# Altium project Prj_ROBOT_HUT_BUI.PrjPcb
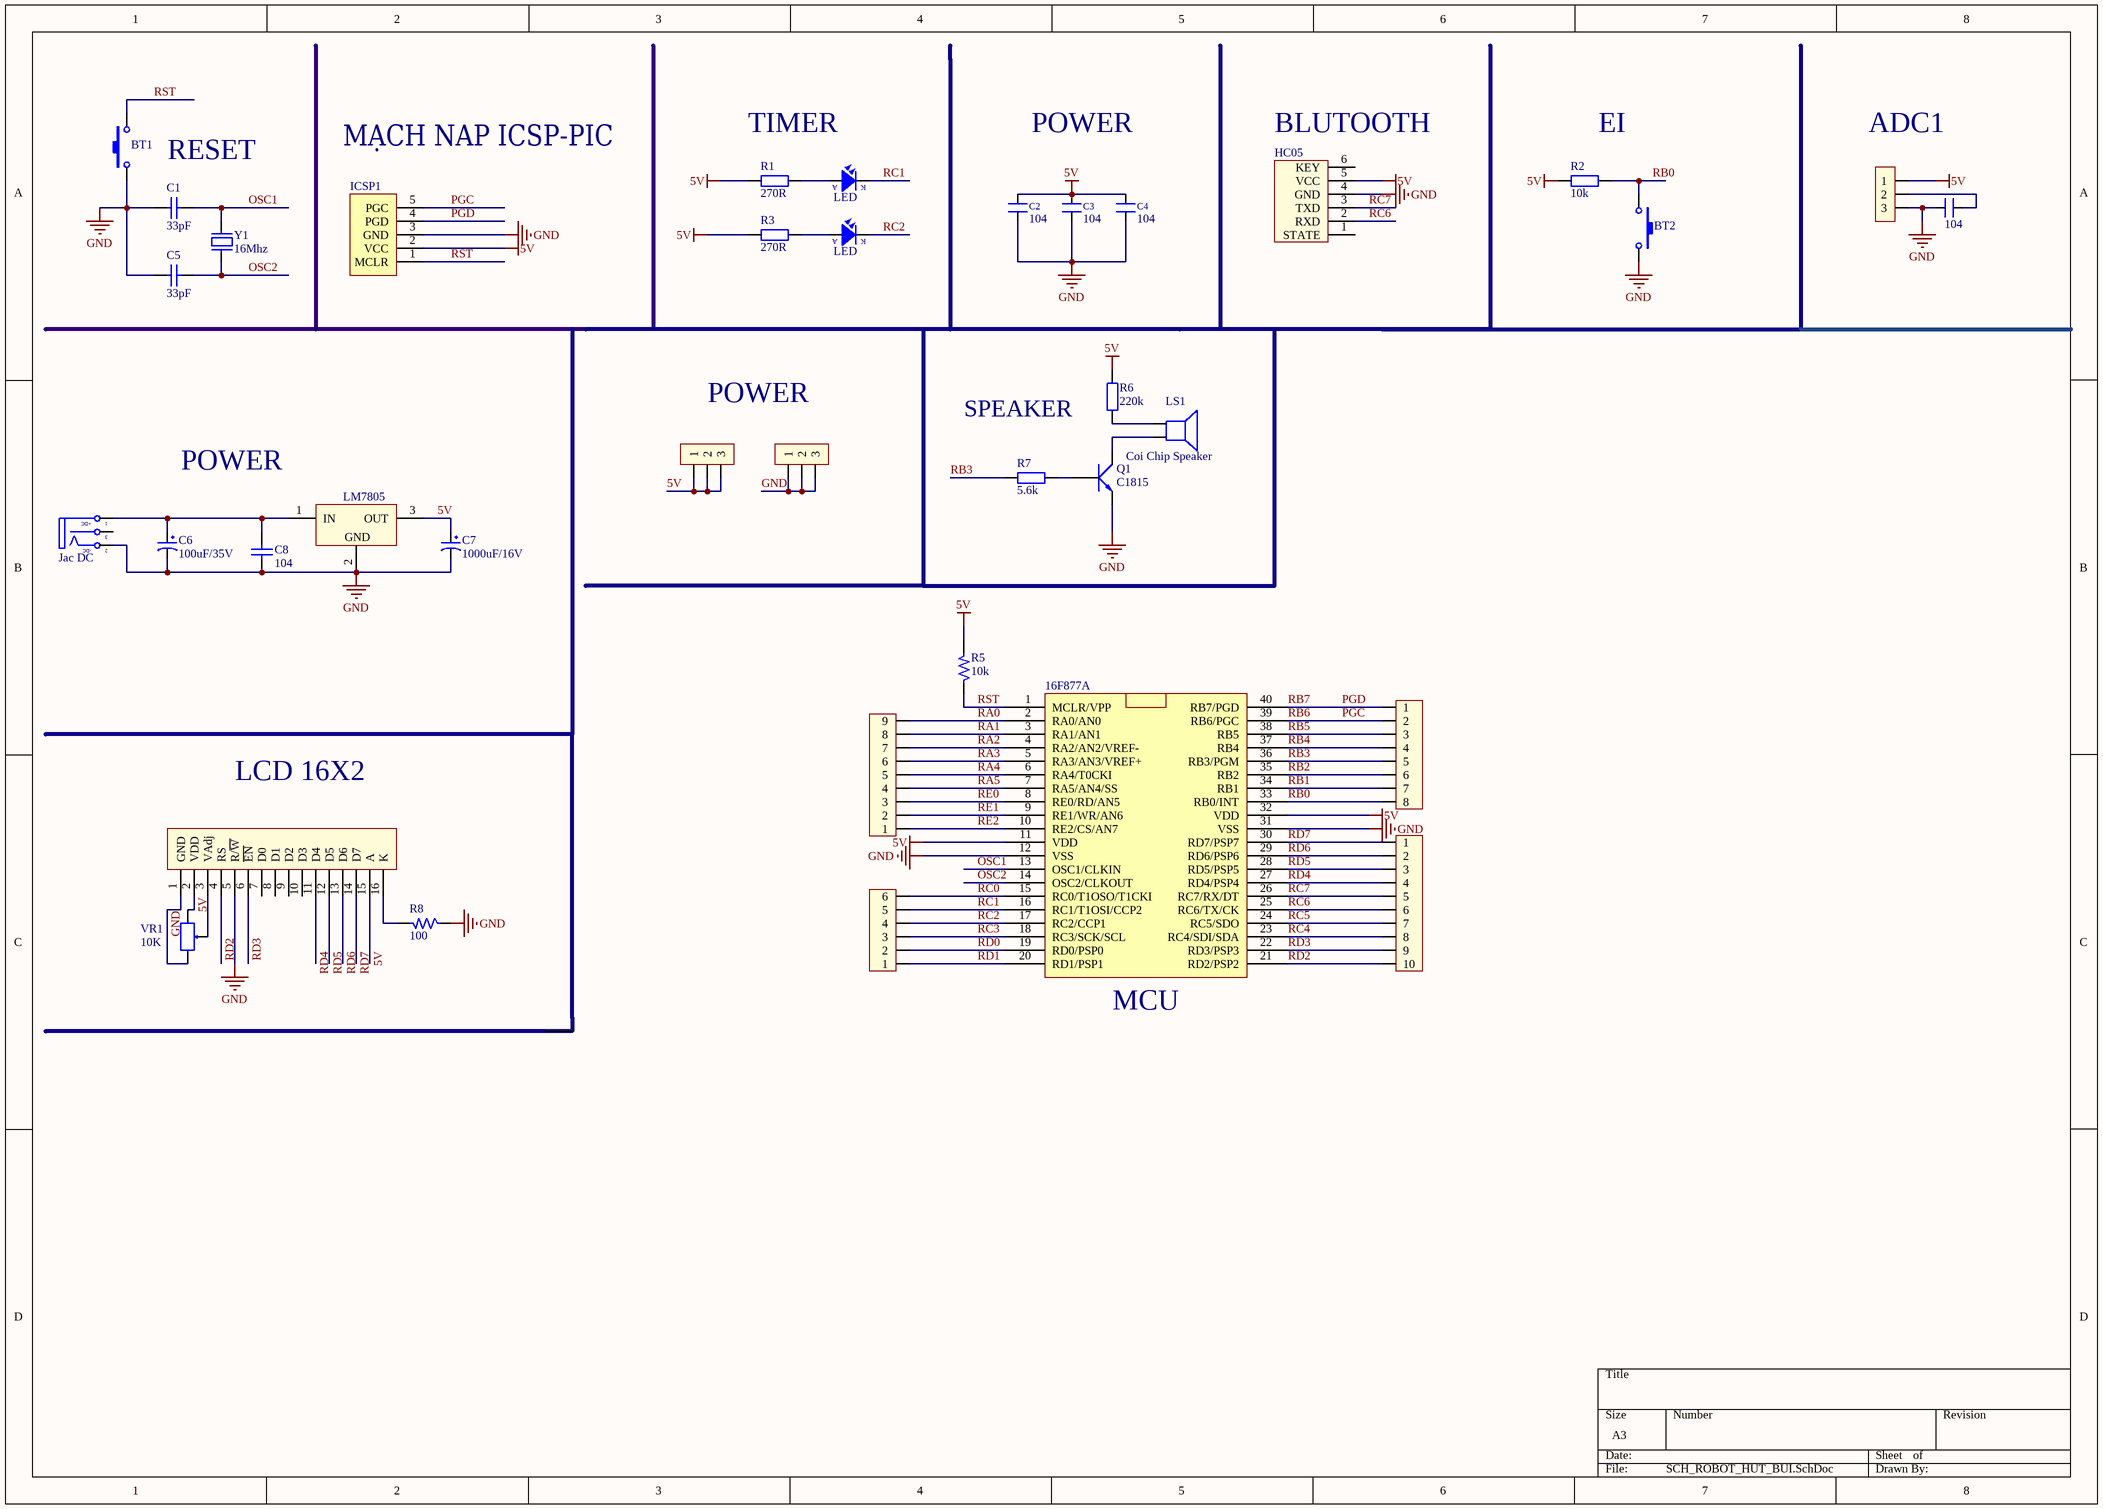
[diagram p0: SCH_ROBOT_HUT_BUI.SchDoc]
1 sheet, 37 parts. Net scope: global (net labels, ports and power ports of the same name join across sheets).
Board file: PCB_ROBOT_HUT_BUI.PcbDoc

## Sheet SCH_ROBOT_HUT_BUI.SchDoc
size A3

### Parts
ADC1  Jumper 3  [JP3]  (value not drawn)
BT1  Nut Nhan 2 Chan SMD 3x6x2.5  [Nut Nhan 2 Chan SMD 3x6x2.5]  (value not drawn)
BT2  Nut Nhan 2 Chan SMD 3x6x2.5  [Nut Nhan 2 Chan SMD 3x6x2.5]  (value not drawn)
C1  33pF  [tu 0805]
C2  104  [SM-CAP-0805]
C3  104  [SM-CAP-0805]
C4  104  [SM-CAP-0805]
C5  33pF  [tu 0805]
C6  100uF/35V  [CP1.5/3.4]
C7  1000uF/16V  [CP1.5/3.4]
C8  104  [tu 0805]
C9  104  [SM-CAP-0805]
HC05  HC05 Bluetooth  [HC05 Bluethooth Nam]  (value not drawn)
IC1  LM7805  [QTO-220]
IC2  16F877A  [DIP40/W0.6]
ICSP1  ICSP-PIC  [HDR1X5]  (value not drawn)
J1  Jumper 3  [JP3]  (value not drawn)
J3  Jumper 3  [JP3]  (value not drawn)
JDC1  Jac DC  [DC-IN]
JP1  JP8  [CON8]  (value not drawn)
JP2  connector  [con9]  (value not drawn)
JP3  JP10  [CON10]  (value not drawn)
JP4  JP6  [CON6]  (value not drawn)
LCD1  LCD1602 XL  [LCD1602 with Jump]  (value not drawn)
LED1  LED  [LED-3]
LED2  LED  [LED-3]
LS1  Coi Chip Speaker  [Coi Chip Speacker]
Q1  C1815  [TO92]
R1  270R  [tro vach 1/4w]
R2  10k  [tro vach 1/4w]
R3  270R  [tro vach 1/4w]
R5  10k  [R1/4W]
R6  220k  [tro vach 1/2w]
R7  5.6k  [tro vach 1/4w]
R8  100  [SM-RES-1206]
VR1  10K  [VR]
Y1  16Mhz  [Thach Anh 2 chan SMD]

### Nets
5V: ADC1.1 C2.2 C3.2 C4.2 C7.1 HC05.5(VCC) IC1.3(OUT) IC2.11(VDD) IC2.32(VDD) ICSP1.2(VCC) J1.1 J1.2 J1.3 LCD1.2(VDD) LCD1.15(A) R1.1 R2.1 R3.1 R5.2 R6.2 VR1.1
GND: ADC1.3 BT1.1 BT2.2 C1.2 C2.1 C3.1 C4.1 C5.2 C6.2 C7.2 C8.2 C9.1 HC05.4(GND) IC1.2(GND) IC2.12(VSS) IC2.31(VSS) ICSP1.3(GND) J3.1 J3.2 J3.3 JDC1.2(TN) LCD1.1(GND) LCD1.5(R/~{W}) Q1.1(E) R8.1 VR1.3
OSC1: C1.1 IC2.13(OSC1/CLKIN) Y1.2
OSC2: C5.1 IC2.14(OSC2/CLKOUT) Y1.1
PGC: IC2.39(RB6/PGC) ICSP1.5(PGC) JP1.2  [also labelled RB6]
PGD: IC2.40(RB7/PGD) ICSP1.4(PGD) JP1.1  [also labelled RB7]
RA0: IC2.2(RA0/AN0) JP2.9
RA1: IC2.3(RA1/AN1) JP2.8
RA2: IC2.4(RA2/AN2/VREF-) JP2.7
RA3: IC2.5(RA3/AN3/VREF+) JP2.6
RA4: IC2.6(RA4/T0CKI) JP2.5
RA5: IC2.7(RA5/AN4/SS) JP2.4
RB0: BT2.1 IC2.33(RB0/INT) JP1.8 R2.2
RB1: IC2.34(RB1) JP1.7
RB2: IC2.35(RB2) JP1.6
RB3: IC2.36(RB3/PGM) JP1.5 R7.1
RB4: IC2.37(RB4) JP1.4
RB5: IC2.38(RB5) JP1.3
RC0: IC2.15(RC0/T1OSO/T1CKI) JP4.6
RC1: IC2.16(RC1/T1OSI/CCP2) JP4.5 LED1.2(K)
RC2: IC2.17(RC2/CCP1) JP4.4 LED2.2(K)
RC3: IC2.18(RC3/SCK/SCL) JP4.3
RC4: IC2.23(RC4/SDI/SDA) JP3.8
RC5: IC2.24(RC5/SDO) JP3.7
RC6: HC05.2(RXD) IC2.25(RC6/TX/CK) JP3.6
RC7: HC05.3(TXD) IC2.26(RC7/RX/DT) JP3.5
RD0: IC2.19(RD0/PSP0) JP4.2
RD1: IC2.20(RD1/PSP1) JP4.1
RD2: IC2.21(RD2/PSP2) JP3.10 LCD1.4(RS)
RD3: IC2.22(RD3/PSP3) JP3.9 LCD1.6(~{EN})
RD4: IC2.27(RD4/PSP4) JP3.4 LCD1.11(D4)
RD5: IC2.28(RD5/PSP5) JP3.3 LCD1.12(D5)
RD6: IC2.29(RD6/PSP6) JP3.2 LCD1.13(D6)
RD7: IC2.30(RD7/PSP7) JP3.1 LCD1.14(D7)
RE0: IC2.8(RE0/RD/AN5) JP2.3
RE1: IC2.9(RE1/WR/AN6) JP2.2
RE2: IC2.10(RE2/CS/AN7) JP2.1
RST: BT1.2 IC2.1(MCLR/VPP) ICSP1.1(MCLR) R5.1
NetADC1_2: ADC1.2 C9.2
NetC6_1: C6.1 C8.1 IC1.1(IN) JDC1.1(T)
NetLCD1_3: LCD1.3(VAdj) VR1.2
NetLCD1_16: LCD1.16(K) R8.2
NetLED1_1: LED1.1(A) R1.2
NetLED2_1: LED2.1(A) R3.2
NetLS1_1: LS1.1 R6.1
NetLS1_2: LS1.2 Q1.2(C)
NetQ1_3: Q1.3(B) R7.2

Not connected (* = marked no-connect by the designer): HC05 1(STATE) 6(KEY); JDC1 3(S); LCD1 7(D0) 8(D1) 9(D2) 10(D3)

### Notes on the sheet
- RESET
- MẠCH NAP ICSP-PIC
- TIMER
- POWER
- (near HC05) BLUTOOTH
- (near R2) EI
- SPEAKER
- LCD 16X2
- (near IC2) MCU
- (in symbol DCIN) +DC; -DC

### Library data of the parts
ADC1 J1 J3 = JP3: Value: J3
BT1 BT2 = Nut Nhan 2 Chan SMD 3x6x2.5: Ma_Hang: MH001036; Ten: Nút Nhấn 2 Chân 3x6x2.5MM SMD
C1 C5 = Tu 0805 33pF 50V 10%: Dán; Don_Vi: Con; So_Chan: 2; Ten_Linh_Kien: Tụ 0805 33p 10% 50V; Ma_Hang: MH004563; Chung_Loai: Dán; Kieu_Chan: *
C2-C4 C9 = CAP SMD: Value: 0,1uF/300V; Designed by: VanDungEvn
C6 = CP3: Cap 100uF/35V - 470uF/16V; Value: 100uF/35V/50V; Description 1: 1000uF/6,3V - 470uF/16V - 330uF - 25V; Description 2: 220uF/35V - 100uF/50V - 63V - 4,7uF/200V; Description 3: 22uF => 33uF100V - 3,3uF => 4,7uF/250V; Description 4: 2,2uF =>3,3uF/350 - 2,2uF/400V - 1uF/450V
C7 = CP4: Cap 1000uF/16V - 220uF/50V; Description 5: 4,7uF>10uF/250V_3,3uF>10uF/400V - 2,2uF>4,7uF/450V; Description 1: 2200uF-3300uF/6,3V - 1000uF-2200uF/10V; Description 2: 1000uF/16V - 470uF => 1000uF/25V - 100uF/100V; Description 3: 330uF>470uF/35V_220uF>470uF/50V_10uF>22uF/250V; Description 4: 220uF => 330uF/63V - 10uF =>33uF/160 - 200V; Value: 1000uF/16V
C8 = Tu 0805 104 50V 10%: Dán; Don_Vi: Con; So_Chan: 2; Ten_Linh_Kien: Tụ 0805 104-100nF 10% 50V; Ma_Hang: MH004551; Chung_Loai: Dán; Kieu_Chan: *
HC05 = HC05 Bluetooth: Bluetooth HC05; Value: Connector 6
IC1 = LM78xx: On ap +, from + 5 to + 24VDC; Value: LM7805
IC2 = PIC 16F877A
ICSP1 = ICSP-PIC: Header, 5-Pin; LatestRevisionDate: 17-Jul-2002; LatestRevisionNote: Re-released for DXP Platform.; Publisher: Altium Limited
JDC1 = DCIN: Jac DC input; Value: Jac DC
JP1 = Con8: Connector 8; Value: Connector 8
JP2 = Con9: connector 9
JP3 = Con10: Connector 10; Value: Connector 10
JP4 = Con6: Connector 6; Value: Connector 6
LCD1 = LCD1602 XL: LCD 1602 Xanh Lá; Ten: Màn hình LCD 1602 Xanh Lá; Ma_Hang: 67HZ; NCC: NSHOP; CHIP: HD44780
LED1 LED2 = LED: LED Single colour Green and Red; Value: LED 3 ly Single Colour
LS1 = Coi Chip Speaker: Còi chip
Q1 = C1815: NPN transistor; Value: C9014
R1 R3 = Tro Vach 1/4W 5% 270R: Cắm; So_Chan: 2; Ma_Hang: MH007303; Don_Vi: Con; Ten_Linh_Kien: Trở Vạch 1/4w 5% 270R; Chung_Loai: Cắm; Kieu_Chan: *
R2 = Tro Vach 1/4W 1% 10k: Cắm; Don_Vi: Con; So_Chan: 2; Ten_Linh_Kien: Trở Vạch 1/4w 1% 10k; Ma_Hang: MH006349; Chung_Loai: Cắm; Kieu_Chan: *
R5 = Res
R6 = Tro Vach 1/2W 5% 220k: Cắm; Don_Vi: Con; So_Chan: 2; Ten_Linh_Kien: Trở 5% 1/2w 220k; Ma_Hang: MH006190; Chung_Loai: Cắm; Kieu_Chan: *
R7 = Tro Vach 1/4W 5% 5.6k: Cắm; Don_Vi: Con; So_Chan: 2; Ten_Linh_Kien: Trở Vạch 1/4w 5% 5.6k; Ma_Hang: MH007323; Chung_Loai: Cắm; Kieu_Chan: *
R8 = R: Resistor 1/4W; Value: R1/4W - 1K
VR1 = VR: Var Resistor; Value: VR 10K
Y1 = Thach Anh 2 chan SMD: Crystal For all Crystal 2pin.; Value: 4Mhz